# Altium schematic sheet 00.- MIBPlatform.SchDoc: BEAGLE DISPLAY
size A3; Author: JOSE A ESCOBAR; CompanyName: Continental Corporation Rubí; DrawnBy: JOSE A ESCOBAR; Engineer: JOSE A ESCOBAR; Organization: Continental Corporation Rubí; Address1: Medios Desarrollo; Revision: 1.0; Time: BEAGLE DISPLAY; ProjectName: BEAGLE DISPLAY
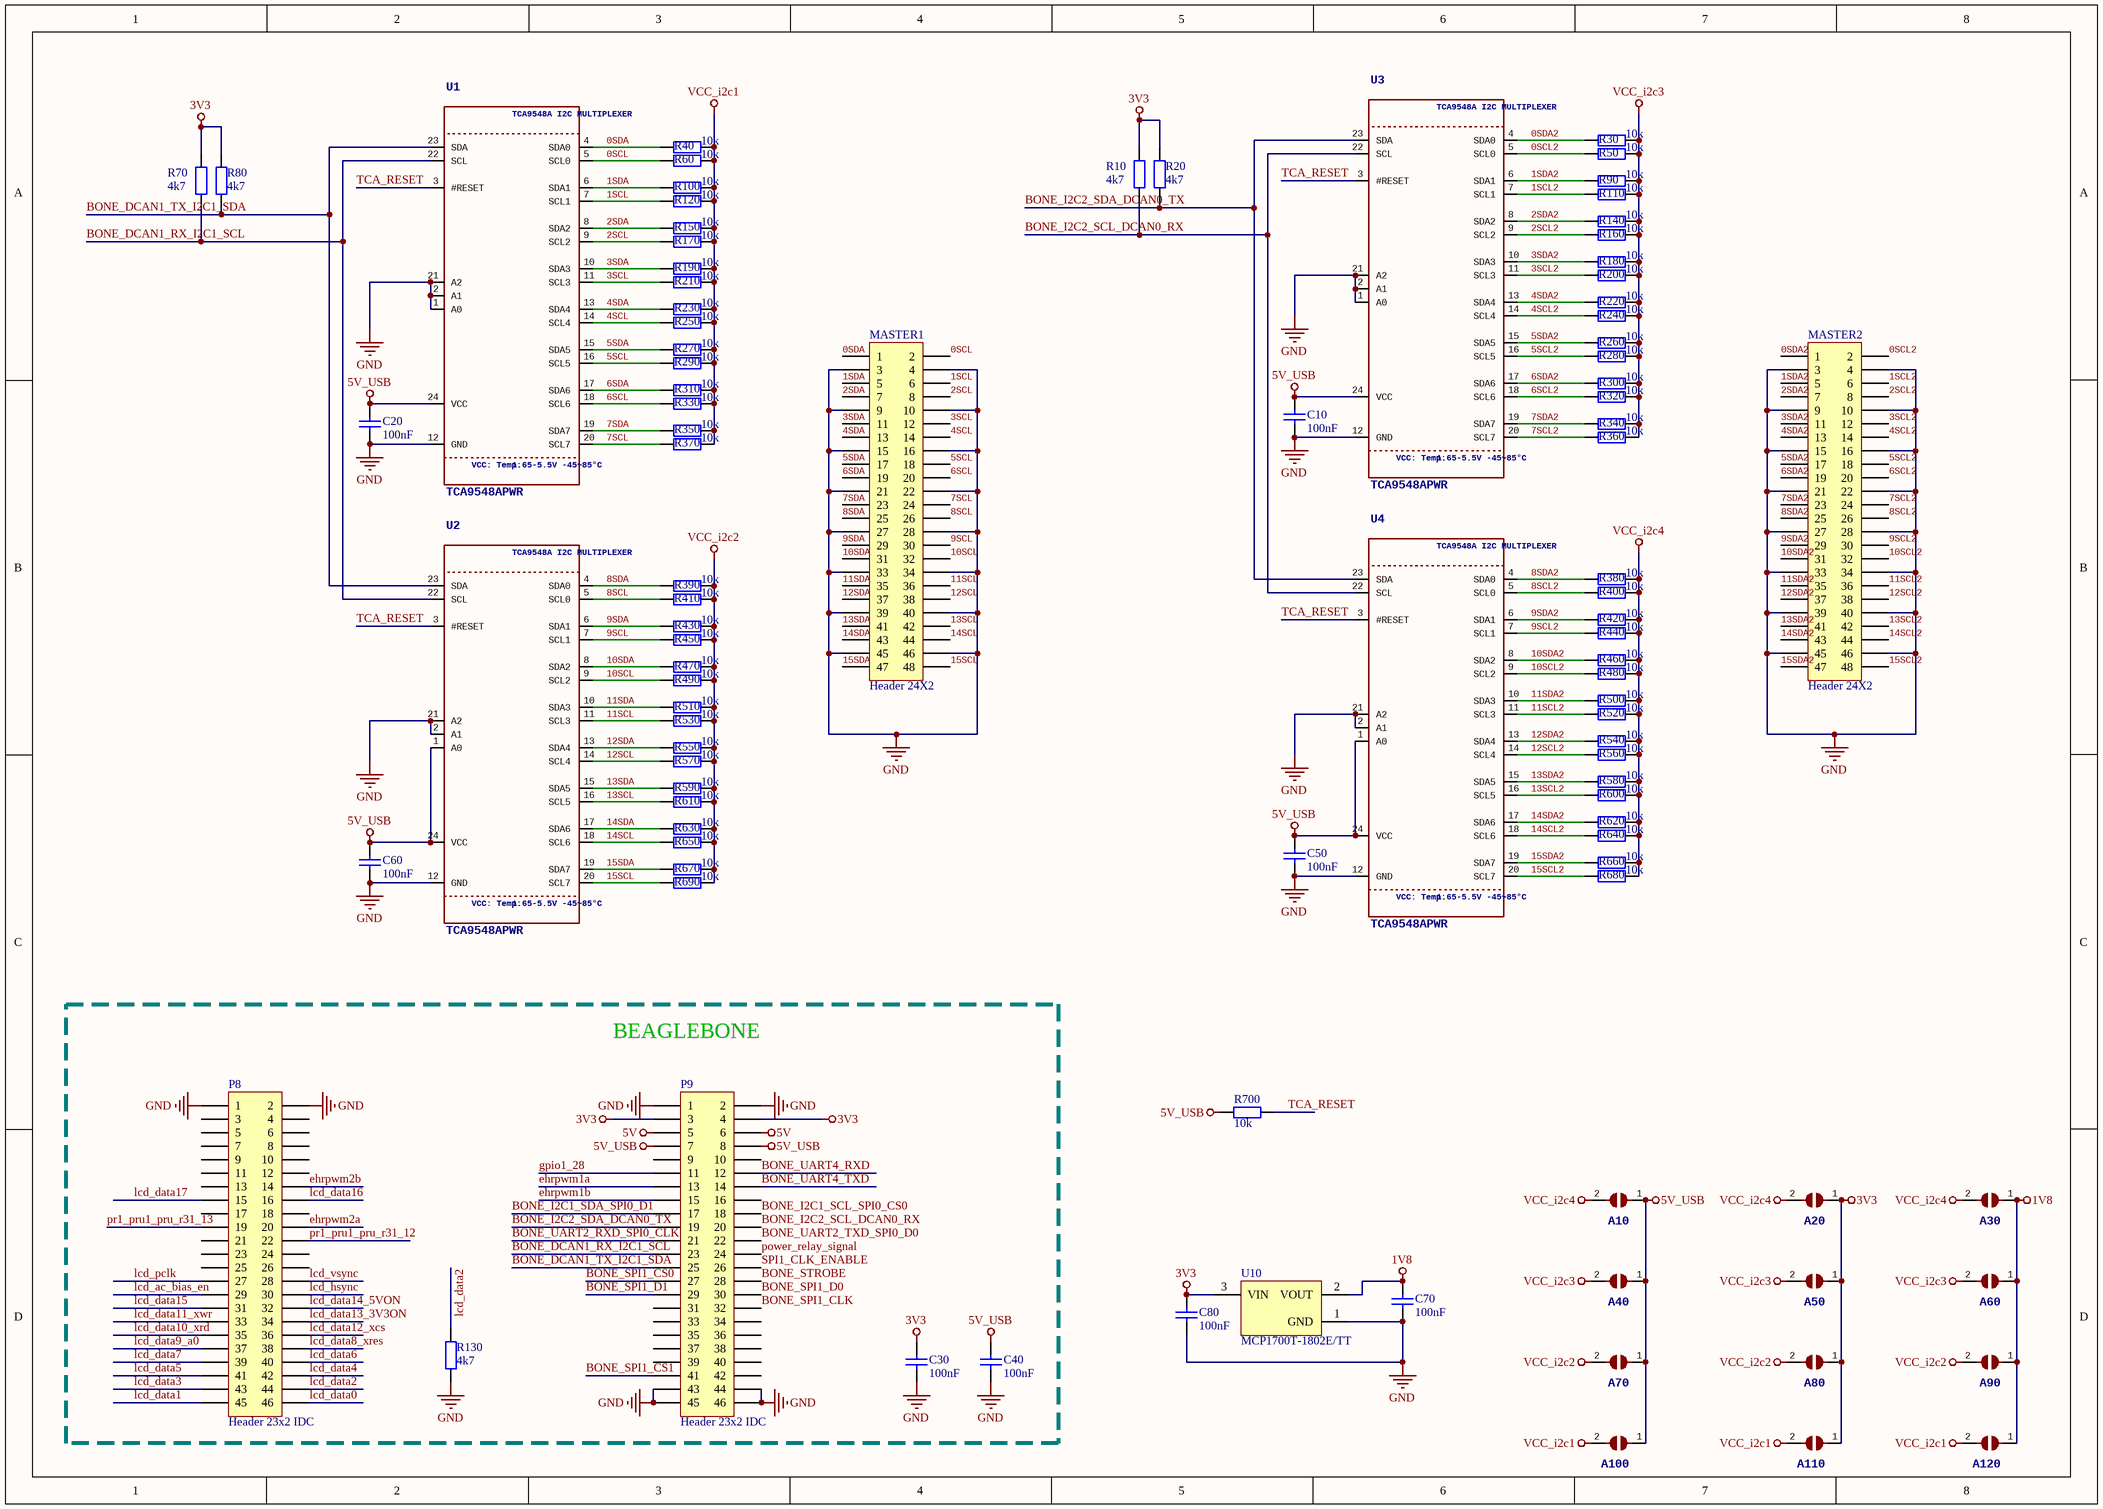
[diagram p0: 00.- MIBPlatform.SchDoc]

## Parts
A10  SOLDERJUMPER  [SOLDERJUMPER_ARROW_NOPASTE]  (value not drawn)
A20  SOLDERJUMPER  [SOLDERJUMPER_ARROW_NOPASTE]  (value not drawn)
A30  SOLDERJUMPER  [SOLDERJUMPER_ARROW_NOPASTE]  (value not drawn)
A40  SOLDERJUMPER  [SOLDERJUMPER_ARROW_NOPASTE]  (value not drawn)
A50  SOLDERJUMPER  [SOLDERJUMPER_ARROW_NOPASTE]  (value not drawn)
A60  SOLDERJUMPER  [SOLDERJUMPER_ARROW_NOPASTE]  (value not drawn)
A70  SOLDERJUMPER  [SOLDERJUMPER_ARROW_NOPASTE]  (value not drawn)
A80  SOLDERJUMPER  [SOLDERJUMPER_ARROW_NOPASTE]  (value not drawn)
A90  SOLDERJUMPER  [SOLDERJUMPER_ARROW_NOPASTE]  (value not drawn)
A100  SOLDERJUMPER  [SOLDERJUMPER_ARROW_NOPASTE]  (value not drawn)
A110  SOLDERJUMPER  [SOLDERJUMPER_ARROW_NOPASTE]  (value not drawn)
A120  SOLDERJUMPER  [SOLDERJUMPER_ARROW_NOPASTE]  (value not drawn)
C10  value 100nF  [0805-NO]  (hidden comment: Cap Semi)
C20  value 100nF  [0805-NO]  (hidden comment: Cap Semi)
C30  value 100nF  [0805-no]  (hidden comment: Cap Semi)
C40  value 100nF  [0805-no]  (hidden comment: Cap Semi)
C50  value 100nF  [0805-NO]  (hidden comment: Cap Semi)
C60  value 100nF  [0805-NO]  (hidden comment: Cap Semi)
C70  value 100nF  [0805-NO]  (hidden comment: Cap Semi)
C80  value 100nF  [0805-NO]  (hidden comment: Cap Semi)
MASTER1  Header 24X2  [HDR2X24]
MASTER2  Header 24X2  [HDR2X24]
P8  Header 23x2 IDC  [tlw-125-05-g-d]
P9  Header 23x2 IDC  [tlw-125-05-g-d]
R10  value 4k7  [0805-NO]  (hidden comment: Res2)
R20  value 4k7  [0805-NO]  (hidden comment: Res2)
R30  value 10k  [0805-NO]  (hidden comment: Res2)
R40  value 10k  [0805-NO]  (hidden comment: Res2)
R50  value 10k  [0805-NO]  (hidden comment: Res2)
R60  value 10k  [0805-NO]  (hidden comment: Res2)
R70  value 4k7  [0805-NO]  (hidden comment: Res2)
R80  value 4k7  [0805-NO]  (hidden comment: Res2)
R90  value 10k  [0805-NO]  (hidden comment: Res2)
R100  value 10k  [0805-NO]  (hidden comment: Res2)
R110  value 10k  [0805-NO]  (hidden comment: Res2)
R120  value 10k  [0805-NO]  (hidden comment: Res2)
R130  value 4k7  [0805-no]  (hidden comment: Res2)
R140  value 10k  [0805-NO]  (hidden comment: Res2)
R150  value 10k  [0805-NO]  (hidden comment: Res2)
R160  value 10k  [0805-NO]  (hidden comment: Res2)
R170  value 10k  [0805-NO]  (hidden comment: Res2)
R180  value 10k  [0805-NO]  (hidden comment: Res2)
R190  value 10k  [0805-NO]  (hidden comment: Res2)
R200  value 10k  [0805-NO]  (hidden comment: Res2)
R210  value 10k  [0805-NO]  (hidden comment: Res2)
R220  value 10k  [0805-NO]  (hidden comment: Res2)
R230  value 10k  [0805-NO]  (hidden comment: Res2)
R240  value 10k  [0805-NO]  (hidden comment: Res2)
R250  value 10k  [0805-NO]  (hidden comment: Res2)
R260  value 10k  [0805-NO]  (hidden comment: Res2)
R270  value 10k  [0805-NO]  (hidden comment: Res2)
R280  value 10k  [0805-NO]  (hidden comment: Res2)
R290  value 10k  [0805-NO]  (hidden comment: Res2)
R300  value 10k  [0805-NO]  (hidden comment: Res2)
R310  value 10k  [0805-NO]  (hidden comment: Res2)
R320  value 10k  [0805-NO]  (hidden comment: Res2)
R330  value 10k  [0805-NO]  (hidden comment: Res2)
R340  value 10k  [0805-NO]  (hidden comment: Res2)
R350  value 10k  [0805-NO]  (hidden comment: Res2)
R360  value 10k  [0805-NO]  (hidden comment: Res2)
R370  value 10k  [0805-NO]  (hidden comment: Res2)
R380  value 10k  [0805-NO]  (hidden comment: Res2)
R390  value 10k  [0805-NO]  (hidden comment: Res2)
R400  value 10k  [0805-NO]  (hidden comment: Res2)
R410  value 10k  [0805-NO]  (hidden comment: Res2)
R420  value 10k  [0805-NO]  (hidden comment: Res2)
R430  value 10k  [0805-NO]  (hidden comment: Res2)
R440  value 10k  [0805-NO]  (hidden comment: Res2)
R450  value 10k  [0805-NO]  (hidden comment: Res2)
R460  value 10k  [0805-NO]  (hidden comment: Res2)
R470  value 10k  [0805-NO]  (hidden comment: Res2)
R480  value 10k  [0805-NO]  (hidden comment: Res2)
R490  value 10k  [0805-NO]  (hidden comment: Res2)
R500  value 10k  [0805-NO]  (hidden comment: Res2)
R510  value 10k  [0805-NO]  (hidden comment: Res2)
R520  value 10k  [0805-NO]  (hidden comment: Res2)
R530  value 10k  [0805-NO]  (hidden comment: Res2)
R540  value 10k  [0805-NO]  (hidden comment: Res2)
R550  value 10k  [0805-NO]  (hidden comment: Res2)
R560  value 10k  [0805-NO]  (hidden comment: Res2)
R570  value 10k  [0805-NO]  (hidden comment: Res2)
R580  value 10k  [0805-NO]  (hidden comment: Res2)
R590  value 10k  [0805-NO]  (hidden comment: Res2)
R600  value 10k  [0805-NO]  (hidden comment: Res2)
R610  value 10k  [0805-NO]  (hidden comment: Res2)
R620  value 10k  [0805-NO]  (hidden comment: Res2)
R630  value 10k  [0805-NO]  (hidden comment: Res2)
R640  value 10k  [0805-NO]  (hidden comment: Res2)
R650  value 10k  [0805-NO]  (hidden comment: Res2)
R660  value 10k  [0805-NO]  (hidden comment: Res2)
R670  value 10k  [0805-NO]  (hidden comment: Res2)
R680  value 10k  [0805-NO]  (hidden comment: Res2)
R690  value 10k  [0805-NO]  (hidden comment: Res2)
R700  value 10k  [0805-NO]  (hidden comment: Res2)
U1  TCA9548APWR  [TSSOP24]
U2  TCA9548APWR  [TSSOP24]
U3  TCA9548APWR  [TSSOP24]
U4  TCA9548APWR  [TSSOP24]
U10  MCP1700T-1802E/TT  [SOT-23-TT3_N]

## Blocks framed on the sheet
BEAGLEBONE: C30 C40 P8 P9 R130

## Nets
1V8: A30.1 A60.1 A90.1 A120.1 C70.1 U10.2(VOUT)
3V3: A20.1 A50.1 A80.1 A110.1 C30.1 C80.1 P9.3 P9.4 R10.2 R20.2 R70.2 R80.2 U10.3(VIN)
5V: P9.5 P9.6
5V_USB: A10.1 A40.1 A70.1 A100.1 C10.1 C20.1 C40.1 C50.1 C60.1 P9.7 P9.8 R700.2 U1.24(VCC) U2.1(A0) U2.24(VCC) U3.24(VCC) U4.1(A0) U4.24(VCC)
GND: C10.2 C20.2 C30.2 C40.2 C50.2 C60.2 C70.2 C80.2 MASTER1.3 MASTER1.4 MASTER1.9 MASTER1.10 MASTER1.15 MASTER1.16 MASTER1.21 MASTER1.22 MASTER1.27 MASTER1.28 MASTER1.33 MASTER1.34 MASTER1.39 MASTER1.40 MASTER1.45 MASTER1.46 MASTER2.3 MASTER2.4 MASTER2.9 MASTER2.10 MASTER2.15 MASTER2.16 MASTER2.21 MASTER2.22 MASTER2.27 MASTER2.28 MASTER2.33 MASTER2.34 MASTER2.39 MASTER2.40 MASTER2.45 MASTER2.46 P8.1 P8.2 P9.1 P9.2 P9.43 P9.44 P9.45 P9.46 R130.2 U1.1(A0) U1.2(A1) U1.12(GND) U1.21(A2) U2.2(A1) U2.12(GND) U2.21(A2) U3.1(A0) U3.2(A1) U3.12(GND) U3.21(A2) U4.2(A1) U4.12(GND) U4.21(A2) U10.1(GND)
VCC_i2c1: A100.2 A110.2 A120.2 R40.1 R60.1 R100.1 R120.1 R150.1 R170.1 R190.1 R210.1 R230.1 R250.1 R270.1 R290.1 R310.1 R330.1 R350.1 R370.1
VCC_i2c2: A70.2 A80.2 A90.2 R390.1 R410.1 R430.1 R450.1 R470.1 R490.1 R510.1 R530.1 R550.1 R570.1 R590.1 R610.1 R630.1 R650.1 R670.1 R690.1
VCC_i2c3: A40.2 A50.2 A60.2 R30.1 R50.1 R90.1 R110.1 R140.1 R160.1 R180.1 R200.1 R220.1 R240.1 R260.1 R280.1 R300.1 R320.1 R340.1 R360.1
VCC_i2c4: A10.2 A20.2 A30.2 R380.1 R400.1 R420.1 R440.1 R460.1 R480.1 R500.1 R520.1 R540.1 R560.1 R580.1 R600.1 R620.1 R640.1 R660.1 R680.1
0SCL: MASTER1.2 R60.2 U1.5(SCL0)
0SCL2: MASTER2.2 R50.2 U3.5(SCL0)
0SDA: MASTER1.1 R40.2 U1.4(SDA0)
0SDA2: MASTER2.1 R30.2 U3.4(SDA0)
1SCL: MASTER1.6 R120.2 U1.7(SCL1)
1SCL2: MASTER2.6 R110.2 U3.7(SCL1)
1SDA: MASTER1.5 R100.2 U1.6(SDA1)
1SDA2: MASTER2.5 R90.2 U3.6(SDA1)
2SCL: MASTER1.8 R170.2 U1.9(SCL2)
2SCL2: MASTER2.8 R160.2 U3.9(SCL2)
2SDA: MASTER1.7 R150.2 U1.8(SDA2)
2SDA2: MASTER2.7 R140.2 U3.8(SDA2)
3SCL: MASTER1.12 R210.2 U1.11(SCL3)
3SCL2: MASTER2.12 R200.2 U3.11(SCL3)
3SDA: MASTER1.11 R190.2 U1.10(SDA3)
3SDA2: MASTER2.11 R180.2 U3.10(SDA3)
4SCL: MASTER1.14 R250.2 U1.14(SCL4)
4SCL2: MASTER2.14 R240.2 U3.14(SCL4)
4SDA: MASTER1.13 R230.2 U1.13(SDA4)
4SDA2: MASTER2.13 R220.2 U3.13(SDA4)
5SCL: MASTER1.18 R290.2 U1.16(SCL5)
5SCL2: MASTER2.18 R280.2 U3.16(SCL5)
5SDA: MASTER1.17 R270.2 U1.15(SDA5)
5SDA2: MASTER2.17 R260.2 U3.15(SDA5)
6SCL: MASTER1.20 R330.2 U1.18(SCL6)
6SCL2: MASTER2.20 R320.2 U3.18(SCL6)
6SDA: MASTER1.19 R310.2 U1.17(SDA6)
6SDA2: MASTER2.19 R300.2 U3.17(SDA6)
7SCL: MASTER1.24 R370.2 U1.20(SCL7)
7SCL2: MASTER2.24 R360.2 U3.20(SCL7)
7SDA: MASTER1.23 R350.2 U1.19(SDA7)
7SDA2: MASTER2.23 R340.2 U3.19(SDA7)
8SCL: MASTER1.26 R410.2 U2.5(SCL0)
8SCL2: MASTER2.26 R400.2 U4.5(SCL0)
8SDA: MASTER1.25 R390.2 U2.4(SDA0)
8SDA2: MASTER2.25 R380.2 U4.4(SDA0)
9SCL: MASTER1.30 R450.2 U2.7(SCL1)
9SCL2: MASTER2.30 R440.2 U4.7(SCL1)
9SDA: MASTER1.29 R430.2 U2.6(SDA1)
9SDA2: MASTER2.29 R420.2 U4.6(SDA1)
10SCL: MASTER1.32 R490.2 U2.9(SCL2)
10SCL2: MASTER2.32 R480.2 U4.9(SCL2)
10SDA: MASTER1.31 R470.2 U2.8(SDA2)
10SDA2: MASTER2.31 R460.2 U4.8(SDA2)
11SCL: MASTER1.36 R530.2 U2.11(SCL3)
11SCL2: MASTER2.36 R520.2 U4.11(SCL3)
11SDA: MASTER1.35 R510.2 U2.10(SDA3)
11SDA2: MASTER2.35 R500.2 U4.10(SDA3)
12SCL: MASTER1.38 R570.2 U2.14(SCL4)
12SCL2: MASTER2.38 R560.2 U4.14(SCL4)
12SDA: MASTER1.37 R550.2 U2.13(SDA4)
12SDA2: MASTER2.37 R540.2 U4.13(SDA4)
13SCL: MASTER1.42 R610.2 U2.16(SCL5)
13SCL2: MASTER2.42 R600.2 U4.16(SCL5)
13SDA: MASTER1.41 R590.2 U2.15(SDA5)
13SDA2: MASTER2.41 R580.2 U4.15(SDA5)
14SCL: MASTER1.44 R650.2 U2.18(SCL6)
14SCL2: MASTER2.44 R640.2 U4.18(SCL6)
14SDA: MASTER1.43 R630.2 U2.17(SDA6)
14SDA2: MASTER2.43 R620.2 U4.17(SDA6)
15SCL: MASTER1.48 R690.2 U2.20(SCL7)
15SCL2: MASTER2.48 R680.2 U4.20(SCL7)
15SDA: MASTER1.47 R670.2 U2.19(SDA7)
15SDA2: MASTER2.47 R660.2 U4.19(SDA7)
BONE_DCAN1_RX_I2C1_SCL: P9.23 R70.1 U1.22(SCL) U2.22(SCL)
BONE_DCAN1_TX_I2C1_SDA: P9.25 R80.1 U1.23(SDA) U2.23(SDA)
BONE_I2C1_SCL_SPI0_CS0: P9.18
BONE_I2C1_SDA_SPI0_D1: P9.17
BONE_I2C2_SCL_DCAN0_RX: P9.20 R10.1 U3.22(SCL) U4.22(SCL)
BONE_I2C2_SDA_DCAN0_TX: P9.19 R20.1 U3.23(SDA) U4.23(SDA)
BONE_SPI1_CLK: P9.32
BONE_SPI1_CS0: P9.27
BONE_SPI1_CS1: P9.41
BONE_SPI1_D0: P9.30
BONE_SPI1_D1: P9.29
BONE_STROBE: P9.28
BONE_UART2_RXD_SPI0_CLK: P9.21
BONE_UART2_TXD_SPI0_D0: P9.22
BONE_UART4_RXD: P9.12
BONE_UART4_TXD: P9.14
ehrpwm1a: P9.13
ehrpwm1b: P9.15
ehrpwm2a: P8.20
ehrpwm2b: P8.14
gpio1_28: P9.11
lcd_ac_bias_en: P8.29
lcd_data0: P8.46
lcd_data1: P8.45
lcd_data2: P8.44 R130.1
lcd_data3: P8.43
lcd_data4: P8.42
lcd_data5: P8.41
lcd_data6: P8.40
lcd_data7: P8.39
lcd_data8_xres: P8.38
lcd_data9_a0: P8.37
lcd_data10_xrd: P8.35
lcd_data11_xwr: P8.33
lcd_data12_xcs: P8.36
lcd_data13_3V3ON: P8.34
lcd_data14_5VON: P8.32
lcd_data15: P8.31
lcd_data16: P8.16
lcd_data17: P8.15
lcd_hsync: P8.30
lcd_pclk: P8.27
lcd_vsync: P8.28
power_relay_signal: P9.24
pr1_pru1_pru_r31_12: P8.22
pr1_pru1_pru_r31_13: P8.19
SPI1_CLK_ENABLE: P9.26
TCA_RESET: R700.1 U1.3(#RESET) U2.3(#RESET) U3.3(#RESET) U4.3(#RESET)

Not connected (* = marked no-connect by the designer): P8 3 4 5 6 7 8 9 10 11 12 13 17 18 21 23 24 25 26; P9 9 10 16 31 33 34 35 36 37 38 39 40 42

## Notes on the sheet
- Title
- Size:
- Date:
- A3
- Number:
- Time:
- Revision:
- Sheet
- of
- File:

## Library data of the parts
A10 A20 A30 A40 A50 A60 A70 A80 A90 A100 A110 A120 = SOLDERJUMPER: <p><b>SMD Solder JUMPER</b></p> / <p>Solder the two pads together to create a connection, or remove the solder to break it.</p> / <b>REFLOW</b> - Use this footprint for solder paste and reflow ovens.<br/> / <b>WAVE</b> - Use this footprint for hand-soldering (larger pads). / <p><b>CLOSED</b> - Has a trace between the two pads to ensure it is closed by default.  The trace needs to be cut to disable the jumper, and can be closed again by creating a solder bridge between the two pads.</p>; BOM: EXCLUDE
C10 C20 C30 C40 C50 C60 C70 C80 = Cap Semi: Capacitor (Semiconductor SIM Model); Manufacturer: Generic Components; Voltage: 50V; Conti: 23; Revision: July-2002: Re-released for DXP Platform.; Supplier: Continental; Supplier ref: A2C00046692
MASTER1 MASTER2 = Header 24X2: Header, 24-Pin, Dual row; LatestRevisionDate: 17-Jul-2002; LatestRevisionNote: Re-released for DXP Platform.; Publisher: Altium Limited
P8 P9 = HW-23-20-G-D-865-SM: header,46 way,2.54mm; Manufacturer: SAMTEC; Manufacturer ref: TSW-123-23-G-D; Supplier: Farnell; Supplier ref: 2029404
R10 R30 R40 R50 R60 R70 R90 R100 R110 R120 R140 R150 R160 R170 R180 R190 R200 R210 R220 R230 R240 R250 R260 R270 R280 R290 R300 R310 R320 R330 R340 R350 R360 R370 R380 R390 R400 R410 R420 R430 R440 R450 R460 R470 R480 R490 R500 R510 R520 R530 R540 R550 R560 R570 R580 R590 R600 R610 R620 R630 R640 R650 R660 R670 R680 R690 R700 = Res2: Resistor; Manufacturer: Generic Components; Conti: 261; Revision: July-2002: Re-released for DXP Platform.
R20 R80 = Res2: Resistor; Manufacturer: Generic Components; Conti: 265; Revision: July-2002: Re-released for DXP Platform.
R130 = Res2: Resistor; Manufacturer: Generic Components; Revision: July-2002: Re-released for DXP Platform.; Supplier: Continental; Supplier ref: A2C00004408
U1-U4 = TCA9548A: <p><b>TCA9548A I2C Multiplexer</b><p>; TCA9548A
U10 = MCP1700T-1802E/TT: Low Quiescent Current LDO, 3-Pin SOT-23, Extended Temperature, Tape and Reel; Published: 29-Jan-2009; DatasheetVersion: revB, Feb-2007; PackageVersion: revBB, Aug-2009; PackageReference: SOT-23-TT3; Publisher: Altium Limited; PackageDescription: 3-Lead Plastic Small Outline Transistor (TT) [SOT-23]; Supplier 1: Digi-Key; Supplier Part Number 1: MCP1700T1802ETTTR-ND; Supplier 2: Digi-Key; Supplier Part Number 2: MCP1700T1802ETTCT-ND; Supplier 3: Digi-Key; Supplier Part Number 3: MCP1700T1802ETTDKR-ND; Supplier 4: Farnell; Supplier Part Number 4: 1296591; Supplier 5: Farnell; Supplier Part Number 5: 1296591RL; Code_IPC: SOT23-3; ComponentLink1Description: Datasheet; ComponentLink1URL: http://ww1.microchip.com/downloads/en/DeviceDoc/21826b.pdf; ComponentLink2Description: Packaging Specification; ComponentLink2URL: http://www.microchip.com/stellent/groups/techpub_sg/documents/packagingspec/en012702.pdf; ComponentLink3Description: Microchip.com Home; ComponentLink3URL: http://www.microchip.com/